# Altium schematic sheet Haptic.SchDoc
size A4; SheetNumber: 7; SheetTotal: 8
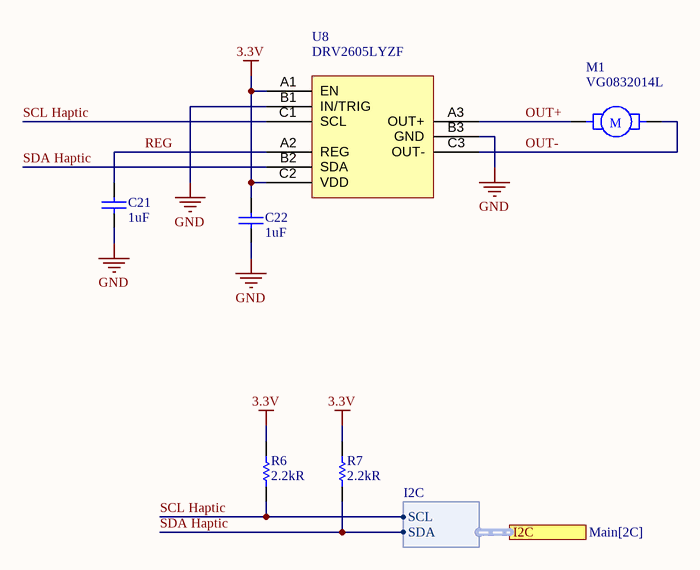
[diagram p0: Haptic.SchDoc]

## Parts
C21  1uF  [Capacitor 0402]
C22  1uF  [Capacitor 0402]
M1  VG0832014L  [VG0832014L]
R6  2.2kR  [Resistor 0402]
R7  2.2kR  [Resistor 0402]
U8  DRV2605LYZF  [DRV2605LYZF]

## Ports
I2C (harness I2C, see Main[2C])

## Harnesses
I2C: SCL, SDA

## Nets
3.3V: C22.2 R6.2 R7.2 U8.A1(EN) U8.C2(VDD)
GND: C21.1 C22.1 U8.B1(IN/TRIG) U8.B3(GND)
OUT+: M1.1 U8.A3(OUT+)
OUT-: M1.2 U8.C3(OUT-)
REG: C21.2 U8.A2(REG)
SCL Haptic: R6.1 U8.C1(SCL) ; port I2C.SCL
SDA Haptic: R7.1 U8.B2(SDA)

## Notes on the sheet
- TITLE
- SIZE
- A4
- VARIANT
- PROJECT
- SHEET
- VERSION
- OF
- AUTHOR
- DATE
- (in symbol VG0832014L) M

## Library data of the parts
C21 C22 = Capacitor
R6 R7 = Resistor